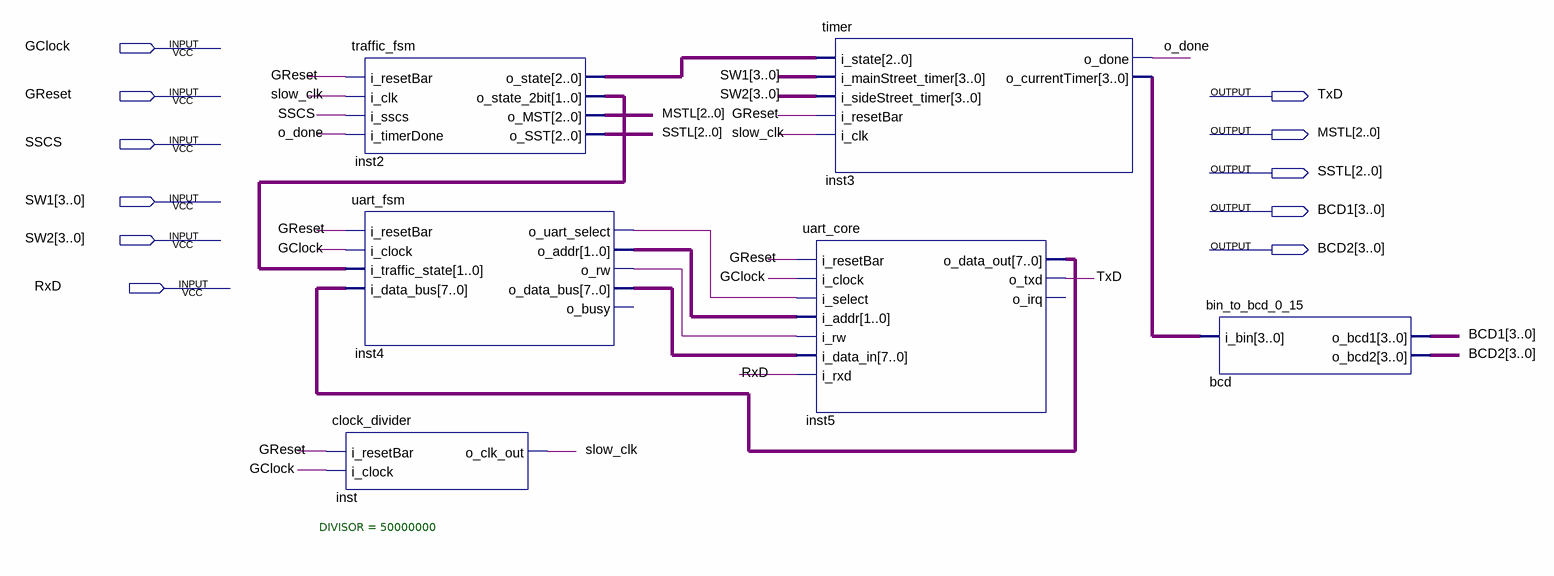
[diagram p0: schematic sheet]
// Quartus schematic top_level.bdf as structural Verilog: 6 symbols, 11 pins
module top_level (
  input  GClock,
  input  GReset,
  input  SSCS,
  input  [3:0] SW1,
  input  [3:0] SW2,
  input  RxD,
  output TxD,
  output [2:0] MSTL,
  output [2:0] SSTL,
  output [3:0] BCD1,
  output [3:0] BCD2
);

  wire inst4_o_rw, inst4_o_uart_select, o_done, slow_clk;
  wire [1:0] inst2_o_state_2bit, inst4_o_addr;
  wire [2:0] inst2_o_state;
  wire [3:0] inst3_o_currenttimer;
  wire [7:0] inst4_o_data_bus, inst5_o_data_out;

  clock_divider #(.DIVISOR(50000000)) inst (.i_resetBar(GReset), .i_clock(GClock), .o_clk_out(slow_clk));
  traffic_fsm inst2 (
    .i_resetBar(GReset), .i_clk(slow_clk), .i_sscs(SSCS), .i_timerDone(o_done), .o_state(inst2_o_state),
    .o_state_2bit(inst2_o_state_2bit), .o_MST(MSTL), .o_SST(SSTL));
  uart_fsm inst4 (
    .i_resetBar(GReset), .i_clock(GClock), .i_traffic_state(inst2_o_state_2bit),
    .i_data_bus(inst5_o_data_out), .o_uart_select(inst4_o_uart_select), .o_addr(inst4_o_addr),
    .o_rw(inst4_o_rw), .o_data_bus(inst4_o_data_bus));  // open: o_busy
  uart_core inst5 (
    .i_resetBar(GReset), .i_clock(GClock), .i_select(inst4_o_uart_select), .i_addr(inst4_o_addr),
    .i_rw(inst4_o_rw), .i_data_in(inst4_o_data_bus), .i_rxd(RxD), .o_data_out(inst5_o_data_out), .o_txd(TxD));  // open: o_irq
  timer inst3 (
    .i_state(inst2_o_state), .i_mainStreet_timer(SW1), .i_sideStreet_timer(SW2), .i_resetBar(GReset),
    .i_clk(slow_clk), .o_done(o_done), .o_currentTimer(inst3_o_currenttimer));
  bin_to_bcd_0_15 bcd (.i_bin(inst3_o_currenttimer), .o_bcd1(BCD1), .o_bcd2(BCD2));
endmodule
